# Altium schematic sheet power-supplies.SchDoc
size A
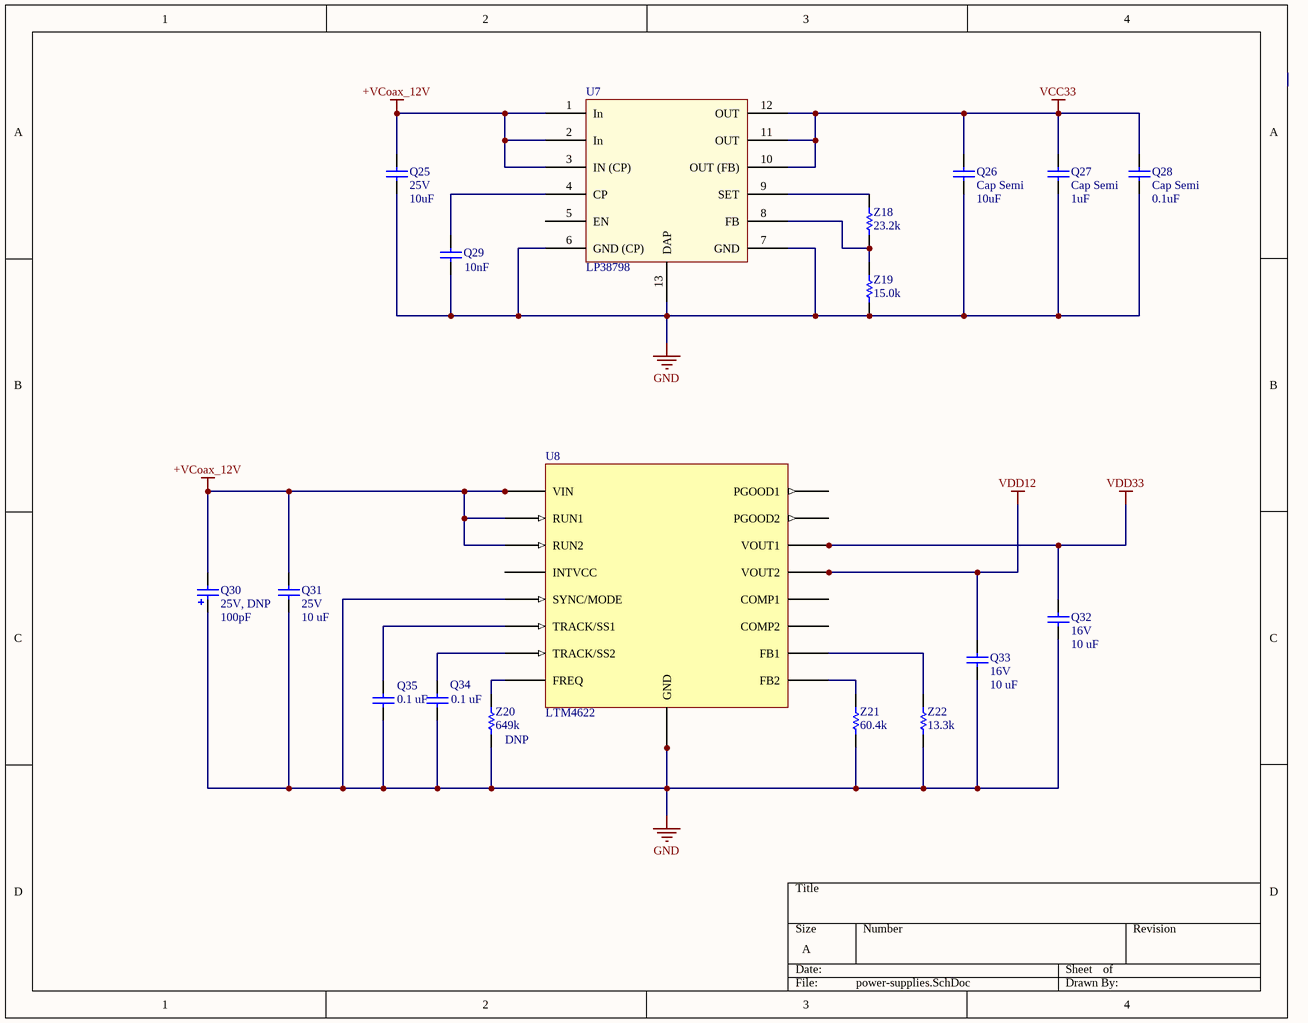
[diagram p0: power-supplies.SchDoc]

## Parts
Q25  25V  value 10uF  [C1206]
Q26  Cap Semi  value 10uF  [Cap-0603]
Q27  Cap Semi  value 1uF  [Cap-0603]
Q28  Cap Semi  value 0.1uF  [Cap-0603]
Q29  value 10nF  [0402]
Q30  25V, DNP  value 100pF  [C0805]
Q31  25V  value 10 uF  [C1206]
Q32  16V  value 10 uF  [C1206]
Q33  16V  value 10 uF  [C1206]
Q34  value 0.1 uF  [C1206]  (hidden comment: 25V)
Q35  value 0.1 uF  [C1206]  (hidden comment: 25V)
U7  LP38798  [DFN12]
U8  LTM4622  [LGA5x5]
Z18  value 23.2k  [Res_0402]  (hidden comment: Res1)
Z19  value 15.0k  [Res_0402]  (hidden comment: Res1)
Z20  DNP  value 649k  [Res_0402]
Z21  value 60.4k  [Res_0402]  (hidden comment: 649k (DNP))
Z22  value 13.3k  [Res_0402]

## Nets
+VCoax_12V: Q25.2 Q30.2 Q31.2 U7.1(In) U7.2(In) U7.3(IN_(CP)) U8.A2(VIN) U8.B2(RUN2) U8.B3(VIN) U8.D2(RUN1) U8.D3(VIN) U8.E2(VIN)
GND: Q25.1 Q26.1 Q27.1 Q28.1 Q29.1 Q30.1 Q31.1 Q32.1 Q33.1 Q34.1 Q35.1 U7.6(GND_(CP)) U7.7(GND) U7.13(DAP) U8.B5(GND) U8.C1(GND) U8.C2(GND) U8.C5(SYNC/MODE) U8.D5(GND) Z19.2 Z20.2 Z21.2 Z22.2
VCC33: Q26.2 Q27.2 Q28.2 U7.10(OUT_(FB)) U7.11(OUT) U7.12(OUT)
VDD12: Q33.2 U8.A1(VOUT2) U8.B1(VOUT2)
VDD33: Q32.2 U8.D1(VOUT1) U8.E1(VOUT1)
NetQ29_2: Q29.2 U7.4(CP)
NetQ34_2: Q34.2 U8.A3(TRACK/SS2)
NetQ35_2: Q35.2 U8.E5(TRACK/SS1)
NetU7_8: U7.8(FB) Z18.2 Z19.1
NetU7_9: U7.9(SET) Z18.1
NetU8_A4: U8.A4(FB2) Z21.1
NetU8_C4: U8.C4(FREQ) Z20.1
NetU8_E4: U8.E4(FB1) Z22.1

Not connected (* = marked no-connect by the designer): U7 5(EN); U8 A5(COMP2) B4(PGOOD2) C3(INTVCC) D4(PGOOD1)

## Library data of the parts
Q25-Q29 Q31-Q35 = Cap Semi: Capacitor (Semiconductor SIM Model); Published: 8-Jun-2000; LatestRevisionDate: 29-May-2009; LatestRevisionNote: IPC-7351 Footprint Added.; PackageReference: C1206; Publisher: Altium Limited; PackageDescription: Chip Capacitor
  Q31 Q34 Q35: Voltage: 25 V
  Q32 Q33: Voltage: 16 V
Q30 = Cap Pol3: Polarized Capacitor (Surface Mount); Published: 8-Jun-2000; LatestRevisionDate: 29-May-2009; LatestRevisionNote: IPC-7351 Footprint Added.; PackageReference: C0805; Publisher: Altium Limited; PackageDescription: Chip Capacitor
U7 = Component_1: Low Noise Positive LDO
Z18-Z22 = Res1: Resistor; Published: 8-Jun-2000; LatestRevisionDate: 17-Jul-2002; LatestRevisionNote: Re-released for DXP Platform.; PackageReference: AXIAL-0.3; Publisher: Altium Limited; PackageDescription: Axial Device, Thru-Hole; 2 Leads; 0.3 in Pin Spacing